# EAGLE schematic E-InkSmartMonitor (EAGLE 9.6.2)
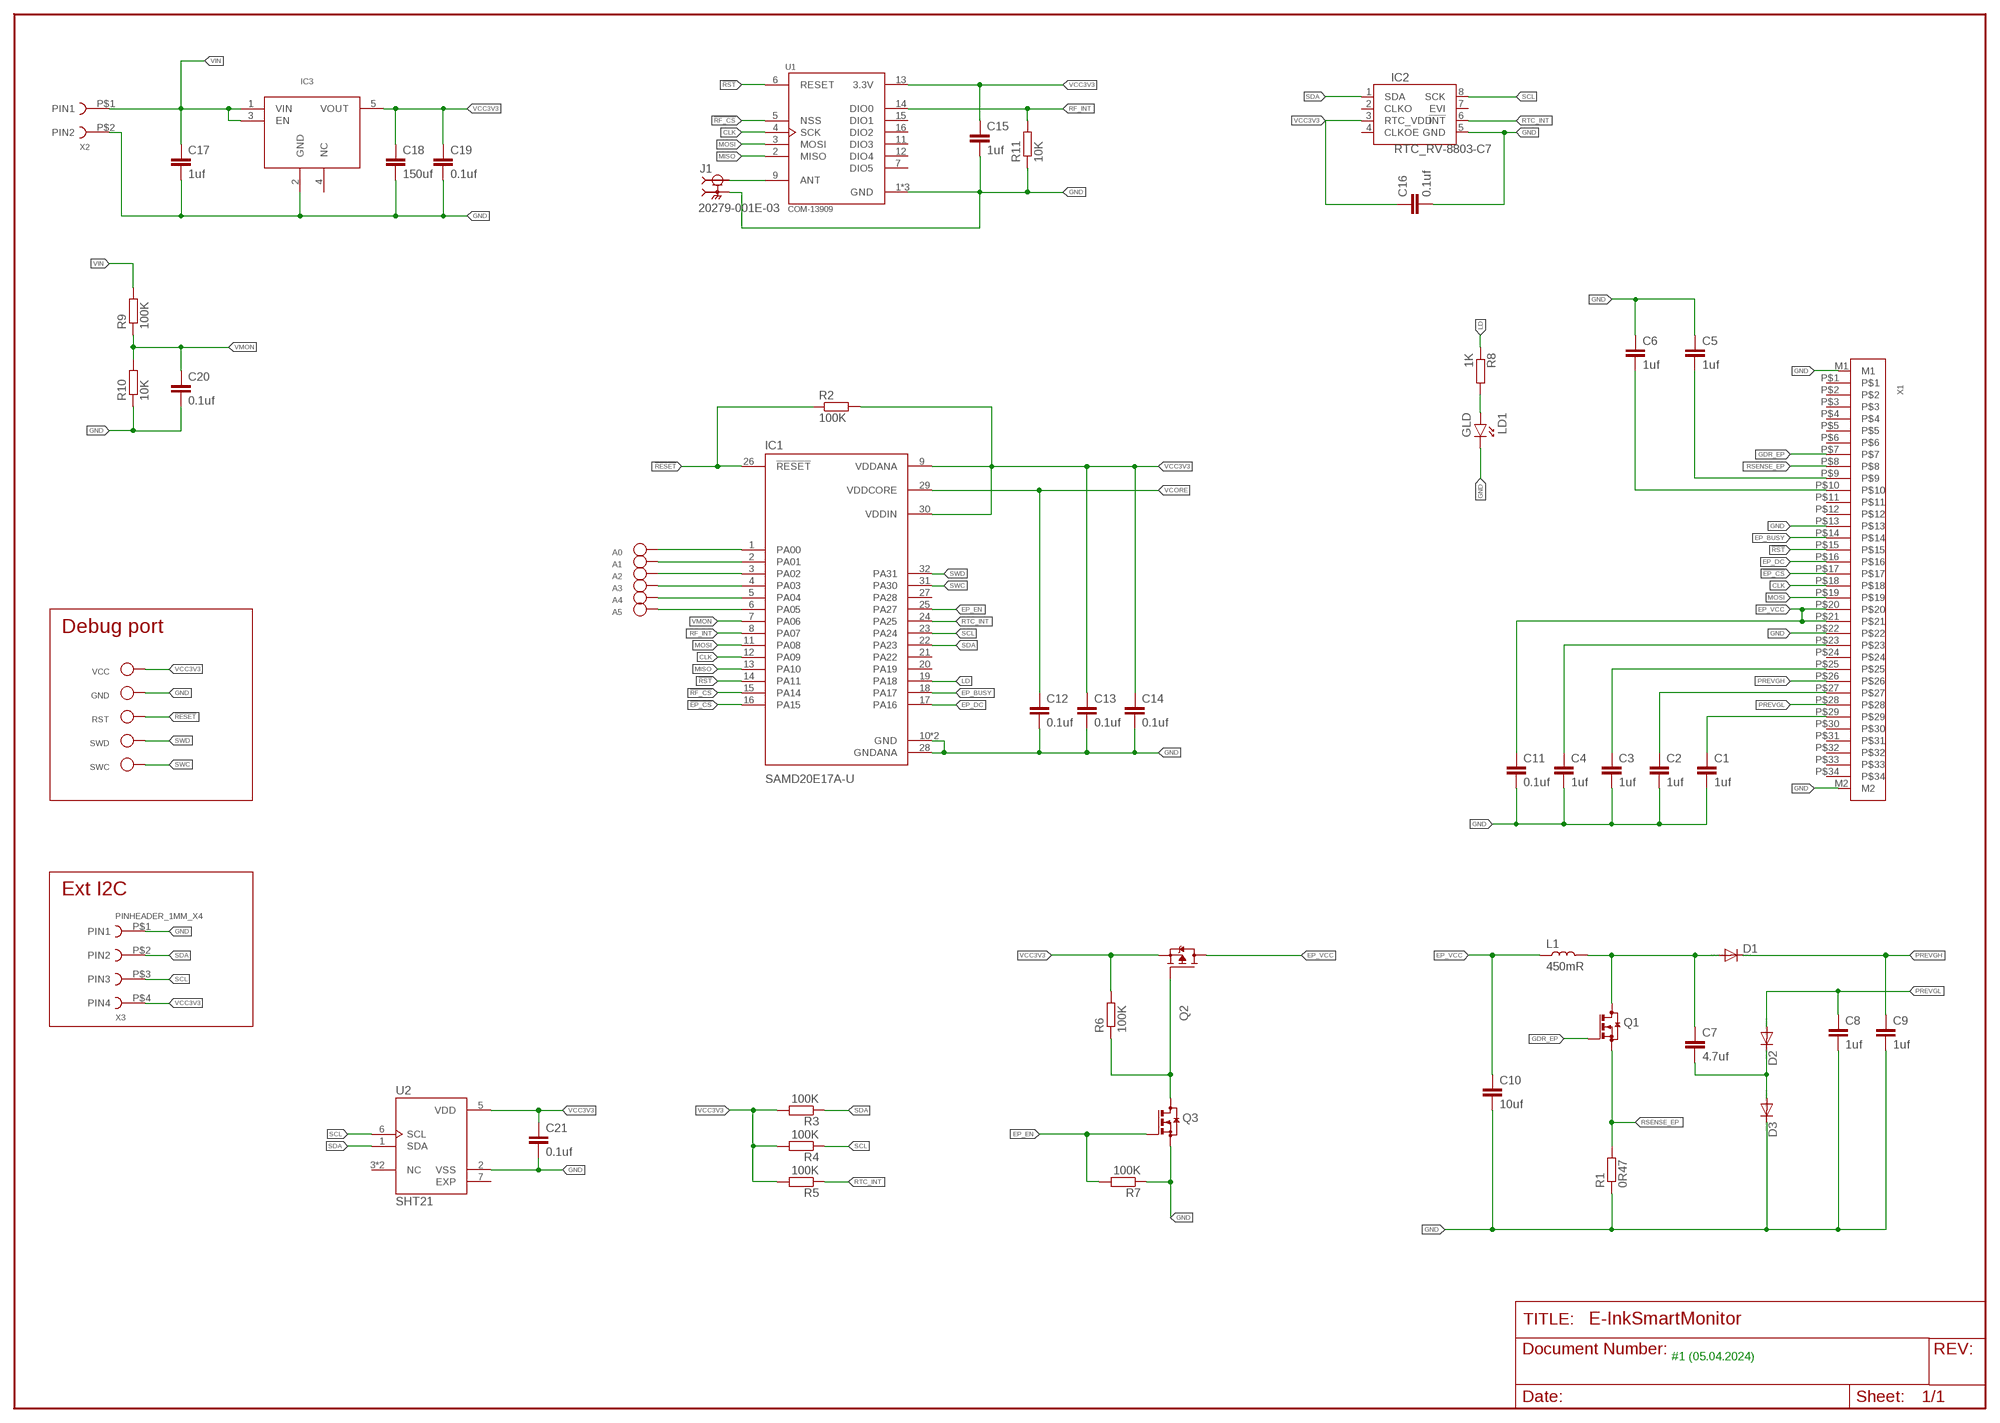
[diagram p0: schematic, sheet 1]

## Parts
A0  TEST_POINT_D2MM  [TP]
A1  TEST_POINT_D2MM  [TP]
A2  TEST_POINT_D2MM  [TP]
A3  TEST_POINT_D2MM  [TP]
A4  TEST_POINT_D2MM  [TP]
A5  TEST_POINT_D2MM  [TP]
C1  1uf  SMD_C0805  [0805]
C2  1uf  SMD_C0805  [0805]
C3  1uf  SMD_C0805  [0805]
C4  1uf  SMD_C0805  [0805]
C5  1uf  SMD_C0805  [0805]
C6  1uf  SMD_C0805  [0805]
C7  4.7uf  SMD_C0805  [0805]
C8  1uf  SMD_C0805  [0805]
C9  1uf  SMD_C0805  [0805]
C10  10uf  SMD_C0805  [0805]
C11  0.1uf  SMD_C0603  [0603]
C12  0.1uf  SMD_C0603  [0603]
C13  0.1uf  SMD_C0603  [0603]
C14  0.1uf  SMD_C0603  [0603]
C15  1uf  SMD_C0805  [0805]
C16  0.1uf  SMD_C0603  [0603]
C17  1uf  SMD_C0805  [0805]
C18  150uf  SMD_C0805  [0805]
C19  0.1uf  SMD_C0603  [0603]
C20  0.1uf  SMD_C0603  [0603]
C21  0.1uf  SMD_C0603  [0603]
D1  DIODE-SOD323-R  [SOD323-R]
D2  DIODE-SOD323-R  [SOD323-R]
D3  DIODE-SOD323-R  [SOD323-R]
GND  TEST_POINT_D2MM  [TP]
IC1  SAMD20E17A-U  [MLF32-TH]
IC2  RTC_RV-8803-C7  [C7_RTC]
IC3  LDO_3.3V_SOT23(5)  [SOT-23(5)]
J1  20279-001E-03  [IPEX_20279-001E-03]
L1  450mR  SMD_L3232  [3232]
LD1  GLD  LED0603  [0603_P]
Q1  BSS123SOT-23-3  [SOT-23(3)]
Q2  P_CH_SOT23SOT-23-3  [SOT-23(3)]
Q3  BSS123SOT-23-3  [SOT-23(3)]
R1  0R47  SMD_R0603  [0603]
R2  100K  SMD_R0603  [0603]
R3  100K  SMD_R0603  [0603]
R4  100K  SMD_R0603  [0603]
R5  100K  SMD_R0603  [0603]
R6  100K  SMD_R0603  [0603]
R7  100K  SMD_R0603  [0603]
R8  1K  SMD_R0603  [0603]
R9  100K  SMD_R0603  [0603]
R10  10K  SMD_R0603  [0603]
R11  10K  SMD_R0603  [0603]
RST  TEST_POINT_D2MM  [TP]
SWC  TEST_POINT_D2MM  [TP]
SWD  TEST_POINT_D2MM  [TP]
U1  COM-13909  [MOD_COM-13909]
U2  SHT21  [XDCR_SHT21]
VCC  TEST_POINT_D2MM  [TP]
X1  FFC_3405EINK  [FFC_3405EINK]
X2  PINHEADER_1MM_X22X_1MM_PIN  [PIN_1MM_X2]
X3  PINHEADER_1MM_X4  [PIN_1MM_X4]

## Nets
!EP_CS: IC1.16(PA15) X1.P$17
!RESET: IC1.26(!RESET) R2.1 RST.P$1
!RF_CS: IC1.15(PA14) U1.5(NSS)
!RST: IC1.14(PA11) U1.6(RESET) X1.P$15
CLK: IC1.12(PA09) U1.4(SCK) X1.P$18
EP_BUSY: IC1.18(PA17) X1.P$14
EP_DC: IC1.17(PA16) X1.P$16
EP_EN: IC1.25(PA27) Q3.1(G) R7.2
EP_VCC: C10.1 C11.1 L1.M Q2.3(D) X1.P$20 X1.P$21
GDR_EP: Q1.1(G) X1.P$7
GND: C1.2 C2.2 C3.2 C4.2 C5.1 C6.1 C8.2 C9.2 C10.2 C11.2 C12.2 C13.2 C14.2 C15.2 C16.2 C17.2 C18.2 C19.2 C20.2 C21.2 D3.C GND.P$1 IC1.10(GND) IC1.28(GNDANA) IC1.TH(GND) IC2.5(GND) IC3.2(GND) J1.2(GND) J1.3(GND) LD1.1(K) Q3.2(S) R1.1 R7.1 R10.1 R11.1 U1.1(GND) U1.8(GND) U1.10(GND) U2.2(VSS) X1.M1 X1.M2 X1.P$13 X1.P$22 X2.P$2(PIN2) X3.P$1(PIN1)
LD: IC1.19(PA18) R8.1
MISO: IC1.13(PA10) U1.2(MISO)
MOSI: IC1.11(PA08) U1.3(MOSI) X1.P$19
N$1: J1.1(SIG) U1.9(ANT)
N$2: Q2.1(G) Q3.3(D) R6.1
N$3: C5.2 X1.P$9
N$4: C6.2 X1.P$10
N$5: C7.1 D1.A L1.P Q1.3(D)
N$7: LD1.2(A) R8.2
N$8: C7.2 D2.C D3.A
N$15: C4.1 X1.P$23
N$16: C3.1 X1.P$25
N$18: C2.1 X1.P$27
N$20: C1.1 X1.P$29
PA00: A0.P$1 IC1.1(PA00)
PA01: A1.P$1 IC1.2(PA01)
PA02: A2.P$1 IC1.3(PA02)
PA03: A3.P$1 IC1.4(PA03)
PA04: A4.P$1 IC1.5(PA04)
PA05: A5.P$1 IC1.6(PA05)
PREVGH: C9.1 D1.C X1.P$26
PREVGL: C8.1 D2.A X1.P$28
RF_INT: IC1.8(PA07) R11.2 U1.14(DIO0)
RSENSE_EP: Q1.2(S) R1.2 X1.P$8
RTC_INT: IC1.24(PA25) IC2.6(!INT) R5.1
SCL: IC1.23(PA24) IC2.8(SCK) R4.1 U2.6(SCL) X3.P$3(PIN3)
SDA: IC1.22(PA23) IC2.1(SDA) R3.1 U2.1(SDA) X3.P$2(PIN2)
SWC: IC1.31(PA30) SWC.P$1
SWD: IC1.32(PA31) SWD.P$1
VCC3V3: C13.1 C14.1 C15.1 C16.1 C18.1 C19.1 C21.1 IC1.9(VDDANA) IC1.30(VDDIN) IC2.3(RTC_VDD) IC3.5(VOUT) Q2.2(S) R2.2 R3.2 R4.2 R5.2 R6.2 U1.13(3.3V) U2.5(VDD) VCC.P$1 X3.P$4(PIN4)
VCORE: C12.1 IC1.29(VDDCORE)
VIN: C17.1 IC3.1(VIN) IC3.3(EN) R9.2 X2.P$1(PIN1)
VMON: C20.1 IC1.7(PA06) R9.1 R10.2
Unconnected: IC1.20(PA19) IC1.21(PA22) IC1.27(PA28) IC2.2(CLKO) IC2.4(CLKOE) IC2.7(EVI) IC3.4(NC) U1.7(DIO5) U1.11(DIO3) U1.12(DIO4) U1.15(DIO1) U1.16(DIO2) U2.3(NC) U2.4(NC) U2.7(EXP) X1.P$1 X1.P$2 X1.P$3 X1.P$4 X1.P$5 X1.P$6 X1.P$11 X1.P$12 X1.P$24 X1.P$30 X1.P$31 X1.P$32 X1.P$33 X1.P$34

## Notes on the sheet
- Debug port
- Ext I2C
- #1 (05.04.2024)

## Library data of the parts
A0 A1-A5 GND RST SWC SWD VCC = passive_components:TEST_POINT_D2MM
C1-C21 = passive_components:SMD_C
D1-D3 = diode:DIODE-: DIODE
IC1 = ATSAMD21J18A-AU:SAMD20E17A-U: A low-power, high-performance Microchip's ARM® Cortex®-M0+ based flash microcontroller, the ATSAMD20E17 is ideal for a wide range of home automation, consumer, metering, and industrial applications. It features: 128KB of flash and 16KB of SRAM Up to 48MHz operating frequency Four serial communication modules (SERCOM) configurable as UART/USART, SPI or I2C, six 16-bit timer/counters, 32-bit Real Time clock and calendar, 10 PWM channels, one 10-channel 12-bit ADC, one 10-bit DAC Support for up to 60 touch channels 1.62V to 3.63V power supply Easy pin migration to SAMD20G and SAMD20J devices
IC2 = my_IC:RTC_RV-8803-C7
IC3 = my_IC:LDO_3.3V_SOT23(5)
J1 = 20279-001E-03:20279-001E-03: Wire to board connector for coaxial cable Check availability <https://pricing.snapeda.com/parts/20279-001E-03/I-PEX/view-part?ref=eda>; AVAILABILITY: In Stock; CHECK_PRICES: https://www.snapeda.com/parts/20279-001E-03/I-PEX/view-part/?ref=eda; DESCRIPTION: 1 POS Vertical SMD Small form factor with big performance through 6 GHz connector,MHF, RF, micro-coaxial MHF I Receptacle; MF: I-PEX; MP: 20279-001E-03; PACKAGE: None; PRICE: None; PURCHASE-URL: https://www.snapeda.com/api/url_track_click_mouser/?unipart_id=3221458&manufacturer=I-PEX&part_name=20279-001E-03&search_term=None; SNAPEDA_LINK: https://www.snapeda.com/parts/20279-001E-03/I-PEX/view-part/?ref=snap
L1 = passive_components:SMD_L
LD1 = passive_components:LED
Q1 Q3 = passive_components:BSS123: N-CHANNEL MOS FET
Q2 = passive_components:P_CH_SOT23: N-CHANNEL MOS FET
R1-R11 = passive_components:SMD_R
U1 = DL-RFM69HC:COM-13909: Rfm69hcw Wireless Transceiver 91 Check availability <https://pricing.snapeda.com/parts/RFM69HCW-315S2/HOPERF/view-part?ref=eda>; AVAILABILITY: Not in stock; CHECK_PRICES: https://www.snapeda.com/parts/RFM69HCW-315S2/HOPERF/view-part/?ref=eda; DESCRIPTION: General ISM < 1GHz Transceiver Module 915MHz Surface Mount; MF: HOPERF; MP: RFM69HCW-315S2; PACKAGE: Module SparkFun Electronics; PRICE: None; SNAPEDA_LINK: https://www.snapeda.com/parts/RFM69HCW-315S2/HOPERF/view-part/?ref=snap
U2 = SHT21:SHT21: Check availability <https://pricing.snapeda.com/parts/SHT21/Sensirion%20AG/view-part?ref=eda> Check availability <https://pricing.snapeda.com/parts/SHT21/Sensirion%20AG/view-part?ref=eda> Check availability <https://pricing.snapeda.com/parts/SHT21/Sensirion%20AG/view-part?ref=eda>; AVAILABILITY: In Stock; CHECK_PRICES: https://www.snapeda.com/parts/SHT21/Sensirion+AG/view-part/?ref=eda; DESCRIPTION: SENSOR HUMID/TEMP 3V I2C 2% SMD; MF: Sensirion AG; MP: SHT21; PACKAGE: DFN-6 Sensirion; PRICE: None; PURCHASE-URL: https://www.snapeda.com/api/url_track_click_mouser/?unipart_id=46060&manufacturer=Sensirion AG&part_name=SHT21&search_term=None; SNAPEDA_LINK: https://www.snapeda.com/parts/SHT21/Sensirion+AG/view-part/?ref=snap
X1 = Custom connectors:FFC_3405EINK
X2 = Custom connectors:PINHEADER_1MM_X2
X3 = Custom connectors:PINHEADER_1MM_X4